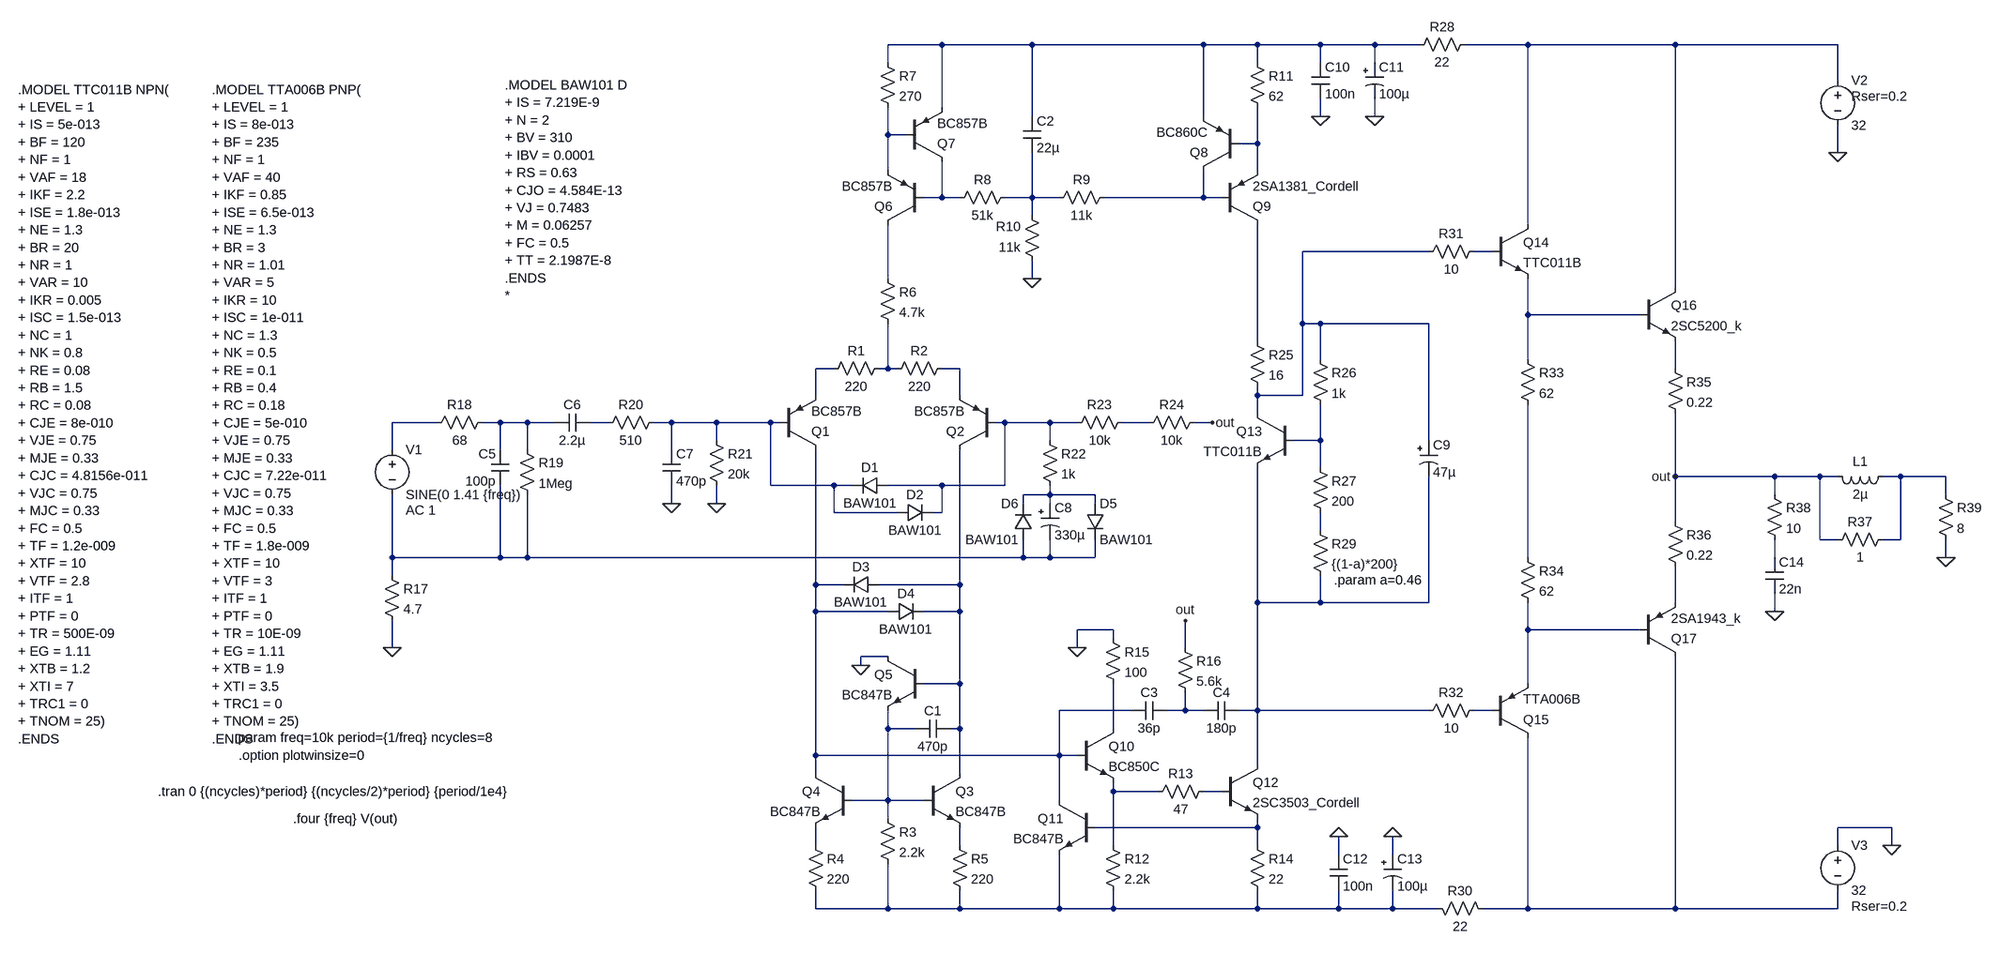
[diagram p0: schematic blameless.asc]
blameless.asc, the LTspice schematic file:
Version 4
SHEET 1 2356 1024
WIRE 416 -560 320 -560
WIRE 576 -560 416 -560
WIRE 880 -560 576 -560
WIRE 976 -560 880 -560
WIRE 1088 -560 976 -560
WIRE 1184 -560 1088 -560
WIRE 1264 -560 1184 -560
WIRE 1456 -560 1344 -560
WIRE 1808 -560 1456 -560
WIRE 2096 -560 1808 -560
WIRE 320 -528 320 -560
WIRE 976 -528 976 -560
WIRE 1088 -528 1088 -560
WIRE 1184 -528 1184 -560
WIRE 2096 -496 2096 -560
WIRE 416 -448 416 -560
WIRE 576 -432 576 -560
WIRE 880 -432 880 -560
WIRE 1088 -432 1088 -464
WIRE 1184 -432 1184 -464
WIRE 320 -400 320 -448
WIRE 352 -400 320 -400
WIRE 976 -384 976 -448
WIRE 976 -384 944 -384
WIRE 2096 -368 2096 -416
WIRE 320 -336 320 -400
WIRE 976 -336 976 -384
WIRE 416 -288 416 -352
WIRE 416 -288 384 -288
WIRE 448 -288 416 -288
WIRE 576 -288 576 -368
WIRE 576 -288 528 -288
WIRE 624 -288 576 -288
WIRE 880 -288 880 -336
WIRE 880 -288 704 -288
WIRE 912 -288 880 -288
WIRE 576 -256 576 -288
WIRE 1456 -240 1456 -560
WIRE 1280 -192 1056 -192
WIRE 1392 -192 1360 -192
WIRE 320 -144 320 -240
WIRE 576 -144 576 -176
WIRE 1808 -128 1808 -560
WIRE 1456 -80 1456 -144
WIRE 1744 -80 1456 -80
WIRE 1056 -64 1056 -192
WIRE 1088 -64 1056 -64
WIRE 1280 -64 1088 -64
WIRE 976 -32 976 -240
WIRE 1088 0 1088 -64
WIRE 1456 0 1456 -80
WIRE 224 16 192 16
WIRE 320 16 320 -64
WIRE 320 16 304 16
WIRE 336 16 320 16
WIRE 448 16 416 16
WIRE 1808 16 1808 -32
WIRE 192 64 192 16
WIRE 448 64 448 16
WIRE 976 64 976 48
WIRE 1056 64 1056 -64
WIRE 1056 64 976 64
WIRE 976 96 976 64
WIRE -480 112 -560 112
WIRE -368 112 -400 112
WIRE -320 112 -368 112
WIRE -272 112 -320 112
WIRE -176 112 -208 112
WIRE -64 112 -96 112
WIRE 16 112 -64 112
WIRE 112 112 16 112
WIRE 128 112 112 112
WIRE 528 112 512 112
WIRE 608 112 528 112
WIRE 656 112 608 112
WIRE 784 112 736 112
WIRE 896 112 864 112
WIRE 16 144 16 112
WIRE 608 144 608 112
WIRE 1088 144 1088 80
WIRE 1088 144 1040 144
WIRE 1280 144 1280 -64
WIRE -560 160 -560 112
WIRE -368 160 -368 112
WIRE -320 160 -320 112
WIRE -64 160 -64 112
WIRE 1088 192 1088 144
WIRE 1808 208 1808 96
WIRE 1984 208 1808 208
WIRE 2064 208 1984 208
WIRE 2096 208 2064 208
WIRE 2208 208 2176 208
WIRE 2288 208 2208 208
WIRE 112 224 112 112
WIRE 224 224 112 224
WIRE 256 224 224 224
WIRE 416 224 320 224
WIRE 528 224 528 112
WIRE 528 224 416 224
WIRE 608 240 608 224
WIRE 608 240 560 240
WIRE 688 240 608 240
WIRE 1984 240 1984 208
WIRE 2288 240 2288 208
WIRE -64 256 -64 224
WIRE 16 256 16 224
WIRE 560 256 560 240
WIRE 608 256 608 240
WIRE 688 256 688 240
WIRE 224 272 224 224
WIRE 336 272 224 272
WIRE 416 272 416 224
WIRE 416 272 400 272
WIRE 1808 288 1808 208
WIRE 1088 304 1088 272
WIRE 2064 320 2064 208
WIRE 2096 320 2064 320
WIRE 2208 320 2208 208
WIRE 2208 320 2176 320
WIRE -560 352 -560 240
WIRE -368 352 -368 224
WIRE -368 352 -560 352
WIRE -320 352 -320 240
WIRE -320 352 -368 352
WIRE 560 352 560 320
WIRE 560 352 -320 352
WIRE 608 352 608 320
WIRE 608 352 560 352
WIRE 688 352 688 320
WIRE 688 352 608 352
WIRE 1456 352 1456 80
WIRE 1984 352 1984 320
WIRE 2288 352 2288 320
WIRE -560 384 -560 352
WIRE 192 400 192 160
WIRE 240 400 192 400
WIRE 448 400 448 160
WIRE 448 400 304 400
WIRE 976 432 976 192
WIRE 1088 432 1088 384
WIRE 1088 432 976 432
WIRE 1280 432 1280 208
WIRE 1280 432 1088 432
WIRE 1808 432 1808 368
WIRE 192 448 192 400
WIRE 320 448 192 448
WIRE 448 448 448 400
WIRE 448 448 384 448
WIRE 1984 448 1984 416
WIRE 720 480 656 480
WIRE 1456 480 1456 432
WIRE 1744 480 1456 480
WIRE 720 496 720 480
WIRE -560 512 -560 464
WIRE 656 512 656 480
WIRE 848 512 848 464
WIRE 320 528 272 528
WIRE 272 544 272 528
WIRE 448 576 448 448
WIRE 448 576 384 576
WIRE 1456 576 1456 480
WIRE 752 624 624 624
WIRE 848 624 848 592
WIRE 848 624 816 624
WIRE 880 624 848 624
WIRE 976 624 976 432
WIRE 976 624 944 624
WIRE 1280 624 976 624
WIRE 1392 624 1360 624
WIRE 320 656 320 624
WIRE 368 656 320 656
WIRE 448 656 448 576
WIRE 448 656 432 656
WIRE 720 656 720 576
WIRE 192 704 192 448
WIRE 624 704 624 624
WIRE 624 704 192 704
WIRE 656 704 624 704
WIRE 976 720 976 624
WIRE 192 736 192 704
WIRE 448 736 448 656
WIRE 720 768 720 752
WIRE 800 768 720 768
WIRE 912 768 880 768
WIRE 320 784 320 656
WIRE 320 784 256 784
WIRE 384 784 320 784
WIRE 624 784 624 704
WIRE 320 816 320 784
WIRE 976 832 976 816
WIRE 976 832 688 832
WIRE 2192 832 2096 832
WIRE 192 864 192 832
WIRE 448 864 448 832
WIRE 720 864 720 768
WIRE 976 864 976 832
WIRE 2096 864 2096 832
WIRE 2192 864 2192 832
WIRE 1120 880 1120 848
WIRE 1216 880 1216 848
WIRE 192 976 192 944
WIRE 320 976 320 896
WIRE 320 976 192 976
WIRE 448 976 448 944
WIRE 448 976 320 976
WIRE 624 976 624 880
WIRE 624 976 448 976
WIRE 720 976 720 944
WIRE 720 976 624 976
WIRE 976 976 976 944
WIRE 976 976 720 976
WIRE 1120 976 1120 944
WIRE 1120 976 976 976
WIRE 1216 976 1216 944
WIRE 1216 976 1120 976
WIRE 1296 976 1216 976
WIRE 1456 976 1456 672
WIRE 1456 976 1376 976
WIRE 1808 976 1808 528
WIRE 1808 976 1456 976
WIRE 2096 976 2096 944
WIRE 2096 976 1808 976
FLAG 272 544 0
FLAG 576 -144 0
FLAG 656 512 0
FLAG -560 512 0
FLAG 16 256 0
FLAG -64 256 0
FLAG 2192 864 0
FLAG 2096 -368 0
FLAG 1088 -432 0
FLAG 1184 -432 0
FLAG 1120 848 0
FLAG 1216 848 0
FLAG 896 112 out
FLAG 848 464 out
FLAG 1808 208 out
FLAG 1984 448 0
FLAG 2288 352 0
SYMBOL diode 320 208 R90
WINDOW 0 0 32 VBottom 2
WINDOW 3 32 32 VTop 2
SYMATTR InstName D1
SYMATTR Value BAW101
SYMBOL pnp 128 160 M180
SYMATTR InstName Q1
SYMATTR Value BC857B
SYMBOL pnp 512 160 R180
SYMATTR InstName Q2
SYMATTR Value BC857B
SYMBOL res 320 0 R90
WINDOW 0 0 56 VBottom 2
WINDOW 3 32 56 VTop 2
SYMATTR InstName R1
SYMATTR Value 220
SYMBOL res 432 0 R90
WINDOW 0 0 56 VBottom 2
WINDOW 3 32 56 VTop 2
SYMATTR InstName R2
SYMATTR Value 220
SYMBOL diode 336 288 R270
WINDOW 0 32 32 VTop 2
WINDOW 3 0 32 VBottom 2
SYMATTR InstName D2
SYMATTR Value BAW101
SYMBOL diode 304 384 R90
WINDOW 0 0 32 VBottom 2
WINDOW 3 32 32 VTop 2
SYMATTR InstName D3
SYMATTR Value BAW101
SYMBOL diode 320 464 R270
WINDOW 0 32 32 VTop 2
WINDOW 3 0 32 VBottom 2
SYMATTR InstName D4
SYMATTR Value BAW101
SYMBOL npn 256 736 M0
SYMATTR InstName Q4
SYMATTR Value BC847B
SYMBOL npn 384 736 R0
SYMATTR InstName Q3
SYMATTR Value BC847B
SYMBOL npn 384 528 M0
SYMATTR InstName Q5
SYMATTR Value BC847B
SYMBOL cap 432 640 R90
WINDOW 0 0 32 VBottom 2
WINDOW 3 32 32 VTop 2
SYMATTR InstName C1
SYMATTR Value 470p
SYMBOL res 304 800 R0
SYMATTR InstName R3
SYMATTR Value 2.2k
SYMBOL res 176 848 R0
SYMATTR InstName R4
SYMATTR Value 220
SYMBOL res 432 848 R0
SYMATTR InstName R5
SYMATTR Value 220
SYMBOL res 304 -160 R0
SYMATTR InstName R6
SYMATTR Value 4.7k
SYMBOL pnp 384 -240 R180
SYMATTR InstName Q6
SYMATTR Value BC857B
SYMBOL pnp 352 -352 M180
SYMATTR InstName Q7
SYMATTR Value BC857B
SYMBOL res 304 -544 R0
SYMATTR InstName R7
SYMATTR Value 270
SYMBOL res 544 -304 R90
WINDOW 0 0 56 VBottom 2
WINDOW 3 32 56 VTop 2
SYMATTR InstName R8
SYMATTR Value 51k
SYMBOL res 720 -304 R90
WINDOW 0 0 56 VBottom 2
WINDOW 3 32 56 VTop 2
SYMATTR InstName R9
SYMATTR Value 11k
SYMBOL res 592 -160 R180
WINDOW 0 36 76 Left 2
WINDOW 3 36 40 Left 2
SYMATTR InstName R10
SYMATTR Value 11k
SYMBOL cap 560 -432 R0
SYMATTR InstName C2
SYMATTR Value 22µ
SYMBOL pnp 944 -336 R180
SYMATTR InstName Q8
SYMATTR Value BC860C
SYMBOL pnp 912 -240 M180
SYMATTR InstName Q9
SYMATTR Value 2SA1381_Cordell
SYMBOL res 960 -544 R0
SYMATTR InstName R11
SYMATTR Value 62
SYMBOL npn 656 656 R0
SYMATTR InstName Q10
SYMATTR Value BC850C
SYMBOL npn 688 784 M0
SYMATTR InstName Q11
SYMATTR Value BC847B
SYMBOL res 704 848 R0
SYMATTR InstName R12
SYMATTR Value 2.2k
SYMBOL res 896 752 R90
WINDOW 0 0 56 VBottom 2
WINDOW 3 32 56 VTop 2
SYMATTR InstName R13
SYMATTR Value 47
SYMBOL npn 912 720 R0
SYMATTR InstName Q12
SYMATTR Value 2SC3503_Cordell
SYMBOL res 960 848 R0
SYMATTR InstName R14
SYMATTR Value 22
SYMBOL res 704 480 R0
SYMATTR InstName R15
SYMATTR Value 100
SYMBOL cap 816 608 R90
WINDOW 0 0 32 VBottom 2
WINDOW 3 32 32 VTop 2
SYMATTR InstName C3
SYMATTR Value 36p
SYMBOL cap 944 608 R90
WINDOW 0 0 32 VBottom 2
WINDOW 3 32 32 VTop 2
SYMATTR InstName C4
SYMATTR Value 180p
SYMBOL res 832 496 R0
SYMATTR InstName R16
SYMATTR Value 5.6k
SYMBOL voltage -560 144 R0
WINDOW 123 24 124 Left 2
WINDOW 39 0 0 Left 0
SYMATTR Value2 AC 1
SYMATTR InstName V1
SYMATTR Value SINE(0 1.41 {freq})
SYMBOL res -576 368 R0
SYMATTR InstName R17
SYMATTR Value 4.7
SYMBOL res -384 96 R90
WINDOW 0 0 56 VBottom 2
WINDOW 3 32 56 VTop 2
SYMATTR InstName R18
SYMATTR Value 68
SYMBOL cap -352 160 M0
SYMATTR InstName C5
SYMATTR Value 100p
SYMBOL res -336 144 R0
SYMATTR InstName R19
SYMATTR Value 1Meg
SYMBOL cap -208 96 R90
WINDOW 0 0 32 VBottom 2
WINDOW 3 32 32 VTop 2
SYMATTR InstName C6
SYMATTR Value 2.2µ
SYMBOL res -80 96 R90
WINDOW 0 0 56 VBottom 2
WINDOW 3 32 56 VTop 2
SYMATTR InstName R20
SYMATTR Value 510
SYMBOL cap -80 160 R0
SYMATTR InstName C7
SYMATTR Value 470p
SYMBOL res 0 128 R0
SYMATTR InstName R21
SYMATTR Value 20k
SYMBOL polcap 592 256 R0
WINDOW 3 24 56 Left 2
SYMATTR Value 330µ
SYMATTR InstName C8
SYMATTR Description Capacitor
SYMATTR Type cap
SYMATTR SpiceLine V=35 Irms=350m Rser=0.96 Lser=0 mfg="Nichicon" pn="UKA1V331MPD" type="Al electrolytic"
SYMBOL res 592 128 R0
SYMATTR InstName R22
SYMATTR Value 1k
SYMBOL diode 672 256 R0
SYMATTR InstName D5
SYMATTR Value BAW101
SYMBOL diode 576 320 R180
WINDOW 0 24 64 Left 2
WINDOW 3 24 0 Left 2
SYMATTR InstName D6
SYMATTR Value BAW101
SYMBOL res 752 96 R90
WINDOW 0 0 56 VBottom 2
WINDOW 3 32 56 VTop 2
SYMATTR InstName R23
SYMATTR Value 10k
SYMBOL res 880 96 R90
WINDOW 0 0 56 VBottom 2
WINDOW 3 32 56 VTop 2
SYMATTR InstName R24
SYMATTR Value 10k
SYMBOL voltage 2096 -512 R0
WINDOW 123 0 0 Left 0
WINDOW 39 24 44 Left 2
SYMATTR SpiceLine Rser=0.2
SYMATTR InstName V2
SYMATTR Value 32
SYMBOL voltage 2096 848 R0
WINDOW 123 0 0 Left 0
WINDOW 39 24 124 Left 2
SYMATTR SpiceLine Rser=0.2
SYMATTR InstName V3
SYMATTR Value 32
SYMBOL res 960 -48 R0
SYMATTR InstName R25
SYMATTR Value 16
SYMBOL npn 1040 96 M0
SYMATTR InstName Q13
SYMATTR Value TTC011B
SYMBOL res 1072 -16 R0
SYMATTR InstName R26
SYMATTR Value 1k
SYMBOL res 1072 176 R0
SYMATTR InstName R27
SYMATTR Value 200
SYMBOL res 1072 288 R0
SYMATTR InstName R29
SYMATTR Value {(1-a)*200}
SYMBOL polcap 1264 144 R0
WINDOW 3 24 56 Left 2
SYMATTR Value 47µ
SYMATTR InstName C9
SYMATTR Description Capacitor
SYMATTR Type cap
SYMATTR SpiceLine V=35 Irms=93m Rser=4.51 Lser=0 mfg="Nichicon" pn="UKA1V470MDD" type="Al electrolytic"
SYMBOL cap 1072 -528 R0
SYMATTR InstName C10
SYMATTR Value 100n
SYMBOL polcap 1168 -528 R0
WINDOW 3 24 56 Left 2
SYMATTR Value 100µ
SYMATTR InstName C11
SYMATTR Description Capacitor
SYMATTR Type cap
SYMATTR SpiceLine V=50 Irms=580m Rser=0.16 Lser=0 mfg="Nichicon" pn="UPL1H101MPH6" type="Al electrolytic"
SYMBOL res 1360 -576 R90
WINDOW 0 0 56 VBottom 2
WINDOW 3 32 56 VTop 2
SYMATTR InstName R28
SYMATTR Value 22
SYMBOL cap 1104 944 M180
WINDOW 0 24 56 Left 2
WINDOW 3 24 8 Left 2
SYMATTR InstName C12
SYMATTR Value 100n
SYMBOL polcap 1200 880 R0
SYMATTR InstName C13
SYMATTR Value 100µ
SYMATTR Description Capacitor
SYMATTR Type cap
SYMATTR SpiceLine V=50 Irms=580m Rser=0.16 Lser=0 mfg="Nichicon" pn="UPL1H101MPH6" type="Al electrolytic"
SYMBOL res 1392 992 M270
WINDOW 0 32 56 VTop 2
WINDOW 3 0 56 VBottom 2
SYMATTR InstName R30
SYMATTR Value 22
SYMBOL npn 1392 -240 R0
SYMATTR InstName Q14
SYMATTR Value TTC011B
SYMBOL pnp 1392 672 M180
SYMATTR InstName Q15
SYMATTR Value TTA006B
SYMBOL res 1376 -208 R90
WINDOW 0 0 56 VBottom 2
WINDOW 3 32 56 VTop 2
SYMATTR InstName R31
SYMATTR Value 10
SYMBOL res 1376 608 R90
WINDOW 0 0 56 VBottom 2
WINDOW 3 32 56 VTop 2
SYMATTR InstName R32
SYMATTR Value 10
SYMBOL res 1440 -16 R0
SYMATTR InstName R33
SYMATTR Value 62
SYMBOL res 1440 336 R0
SYMATTR InstName R34
SYMATTR Value 62
SYMBOL npn 1744 -128 R0
SYMATTR InstName Q16
SYMATTR Value 2SC5200_k
SYMBOL res 1792 0 R0
SYMATTR InstName R35
SYMATTR Value 0.22
SYMBOL res 1792 272 R0
SYMATTR InstName R36
SYMATTR Value 0.22
SYMBOL pnp 1744 528 M180
SYMATTR InstName Q17
SYMATTR Value 2SA1943_k
SYMBOL ind 2192 192 R90
WINDOW 0 5 56 VBottom 2
WINDOW 3 32 56 VTop 2
SYMATTR InstName L1
SYMATTR Value 2µ
SYMBOL res 2192 304 R90
WINDOW 0 0 56 VBottom 2
WINDOW 3 32 56 VTop 2
SYMATTR InstName R37
SYMATTR Value 1
SYMBOL cap 1968 352 R0
SYMATTR InstName C14
SYMATTR Value 22n
SYMBOL res 1968 224 R0
SYMATTR InstName R38
SYMATTR Value 10
SYMBOL res 2272 224 R0
SYMATTR InstName R39
SYMATTR Value 8
TEXT -360 -488 Left 2 !.MODEL BAW101 D \n+ IS = 7.219E-9 \n+ N = 2 \n+ BV = 310 \n+ IBV = 0.0001 \n+ RS = 0.63 \n+ CJO = 4.584E-13 \n+ VJ = 0.7483 \n+ M = 0.06257 \n+ FC = 0.5\n+ TT = 2.1987E-8\n.ENDS\n*
TEXT 1112 392 Left 2 !.param a=0.46
TEXT -880 -480 Left 2 !.MODEL TTA006B PNP(\n+ LEVEL = 1\n+ IS = 8e-013\n+ BF = 235\n+ NF = 1\n+ VAF = 40\n+ IKF = 0.85\n+ ISE = 6.5e-013\n+ NE = 1.3\n+ BR = 3\n+ NR = 1.01\n+ VAR = 5\n+ IKR = 10\n+ ISC = 1e-011\n+ NC = 1.3\n+ NK = 0.5\n+ RE = 0.1\n+ RB = 0.4\n+ RC = 0.18\n+ CJE = 5e-010\n+ VJE = 0.75\n+ MJE = 0.33\n+ CJC = 7.22e-011\n+ VJC = 0.75\n+ MJC = 0.33\n+ FC = 0.5\n+ TF = 1.8e-009\n+ XTF = 10\n+ VTF = 3\n+ ITF = 1\n+ PTF = 0\n+ TR = 10E-09\n+ EG = 1.11\n+ XTB = 1.9\n+ XTI = 3.5\n+ TRC1 = 0\n+ TNOM = 25)\n.ENDS
TEXT -1224 -480 Left 2 !.MODEL TTC011B NPN(\n+ LEVEL = 1\n+ IS = 5e-013\n+ BF = 120\n+ NF = 1\n+ VAF = 18\n+ IKF = 2.2\n+ ISE = 1.8e-013\n+ NE = 1.3\n+ BR = 20\n+ NR = 1\n+ VAR = 10\n+ IKR = 0.005\n+ ISC = 1.5e-013\n+ NC = 1\n+ NK = 0.8\n+ RE = 0.08\n+ RB = 1.5\n+ RC = 0.08\n+ CJE = 8e-010\n+ VJE = 0.75\n+ MJE = 0.33\n+ CJC = 4.8156e-011\n+ VJC = 0.75\n+ MJC = 0.33\n+ FC = 0.5\n+ TF = 1.2e-009\n+ XTF = 10\n+ VTF = 2.8\n+ ITF = 1\n+ PTF = 0\n+ TR = 500E-09\n+ EG = 1.11\n+ XTB = 1.2\n+ XTI = 7\n+ TRC1 = 0\n+ TNOM = 25)\n.ENDS
TEXT -840 672 Left 2 !.param freq=10k period={1/freq} ncycles=8
TEXT -832 704 Left 2 !.option plotwinsize=0
TEXT -736 816 Left 2 !.four {freq} V(out)
TEXT -976 768 Left 2 !.tran 0 {(ncycles)*period} {(ncycles/2)*period} {period/1e4}

The netlist it stands for:
* blameless.asc
D1 N021 N020 BAW101
Q1 N030 N020 N013 0 BC857B
Q2 N031 N021 N015 0 BC857B
R1 N014 N013 220
R2 N015 N014 220
D2 N020 N021 BAW101
D3 N031 N030 BAW101
D4 N030 N031 BAW101
Q4 N030 N037 N042 0 BC847B
Q3 N031 N037 N043 0 BC847B
Q5 0 N031 N037 0 BC847B
C1 N031 N037 470p
R3 N037 N044 2.2k
R4 N042 N044 220
R5 N043 N044 220
R6 N010 N014 4.7k
Q6 N010 N005 N003 0 BC857B
Q7 N005 N003 N001 0 BC857B
R7 N001 N003 270
R8 N006 N005 51k
R9 N007 N006 11k
R10 0 N006 11k
C2 N001 N006 22µ
Q8 N007 N004 N001 0 BC860C
Q9 N012 N007 N004 0 2SA1381_Cordell
R11 N001 N004 62
Q10 N038 N030 N039 0 BC850C
Q11 N030 N041 N044 0 BC847B
R12 N039 N044 2.2k
R13 N040 N039 47
Q12 N032 N040 N041 0 2SC3503_Cordell
R14 N041 N044 22
R15 0 N038 100
C3 N035 N030 36p
C4 N032 N035 180p
R16 out N035 5.6k
V1 N017 N027 SINE(0 1.41 {freq}) AC 1
R17 N027 0 4.7
R18 N018 N017 68
C5 N018 N027 100p
R19 N018 N027 1Meg
C6 N019 N018 2.2µ
R20 N020 N019 510
C7 N020 0 470p
R21 N020 0 20k
C8 N025 N027 330µ V=35 Irms=350m Rser=0.96 Lser=0 mfg="Nichicon" pn="UKA1V331MPD" type="Al electrolytic"
R22 N021 N025 1k
D5 N025 N027 BAW101
D6 N027 N025 BAW101
R23 N022 N021 10k
R24 out N022 10k
V2 N002 0 32 Rser=0.2
V3 0 N045 32 Rser=0.2
R25 N012 N008 16
Q13 N008 N023 N032 0 TTC011B
R26 N008 N023 1k
R27 N023 N026 200
R29 N026 N032 {(1-a)*200}
C9 N008 N032 47µ V=35 Irms=93m Rser=4.51 Lser=0 mfg="Nichicon" pn="UKA1V470MDD" type="Al electrolytic"
C10 N001 0 100n
C11 N001 0 100µ V=50 Irms=580m Rser=0.16 Lser=0 mfg="Nichicon" pn="UPL1H101MPH6" type="Al electrolytic"
R28 N002 N001 22
C12 N044 0 100n
C13 0 N044 100µ V=50 Irms=580m Rser=0.16 Lser=0 mfg="Nichicon" pn="UPL1H101MPH6" type="Al electrolytic"
R30 N045 N044 22
Q14 N002 N009 N011 0 TTC011B
Q15 N045 N036 N034 0 TTA006B
R31 N009 N008 10
R32 N036 N032 10
R33 N011 N028 62
R34 N028 N034 62
Q16 N002 N011 N016 0 2SC5200_k
R35 N016 out 0.22
R36 out N033 0.22
Q17 N045 N034 N033 0 2SA1943_k
L1 N024 out 2µ
R37 N024 out 1
C14 N029 0 22n
R38 out N029 10
R39 N024 0 8
.model D D
.lib standard.dio
.model NPN NPN
.model PNP PNP
.lib standard.bjt
.MODEL BAW101 D
+ IS = 7.219E-9
+ N = 2
+ BV = 310
+ IBV = 0.0001
+ RS = 0.63
+ CJO = 4.584E-13
+ VJ = 0.7483
+ M = 0.06257
+ FC = 0.5
+ TT = 2.1987E-8
.ENDS
*
.param a=0.46
.MODEL TTA006B PNP(
+ LEVEL = 1
+ IS = 8e-013
+ BF = 235
+ NF = 1
+ VAF = 40
+ IKF = 0.85
+ ISE = 6.5e-013
+ NE = 1.3
+ BR = 3
+ NR = 1.01
+ VAR = 5
+ IKR = 10
+ ISC = 1e-011
+ NC = 1.3
+ NK = 0.5
+ RE = 0.1
+ RB = 0.4
+ RC = 0.18
+ CJE = 5e-010
+ VJE = 0.75
+ MJE = 0.33
+ CJC = 7.22e-011
+ VJC = 0.75
+ MJC = 0.33
+ FC = 0.5
+ TF = 1.8e-009
+ XTF = 10
+ VTF = 3
+ ITF = 1
+ PTF = 0
+ TR = 10E-09
+ EG = 1.11
+ XTB = 1.9
+ XTI = 3.5
+ TRC1 = 0
+ TNOM = 25)
.ENDS
.MODEL TTC011B NPN(
+ LEVEL = 1
+ IS = 5e-013
+ BF = 120
+ NF = 1
+ VAF = 18
+ IKF = 2.2
+ ISE = 1.8e-013
+ NE = 1.3
+ BR = 20
+ NR = 1
+ VAR = 10
+ IKR = 0.005
+ ISC = 1.5e-013
+ NC = 1
+ NK = 0.8
+ RE = 0.08
+ RB = 1.5
+ RC = 0.08
+ CJE = 8e-010
+ VJE = 0.75
+ MJE = 0.33
+ CJC = 4.8156e-011
+ VJC = 0.75
+ MJC = 0.33
+ FC = 0.5
+ TF = 1.2e-009
+ XTF = 10
+ VTF = 2.8
+ ITF = 1
+ PTF = 0
+ TR = 500E-09
+ EG = 1.11
+ XTB = 1.2
+ XTI = 7
+ TRC1 = 0
+ TNOM = 25)
.ENDS
.param freq=10k period={1/freq} ncycles=8
.option plotwinsize=0
.four {freq} V(out)
.tran 0 {(ncycles)*period} {(ncycles/2)*period} {period/1e4}
.backanno
.end